# EAGLE schematic Cyclone-Pulse-Wrangler-Mainboard (EAGLE 9.6.2)
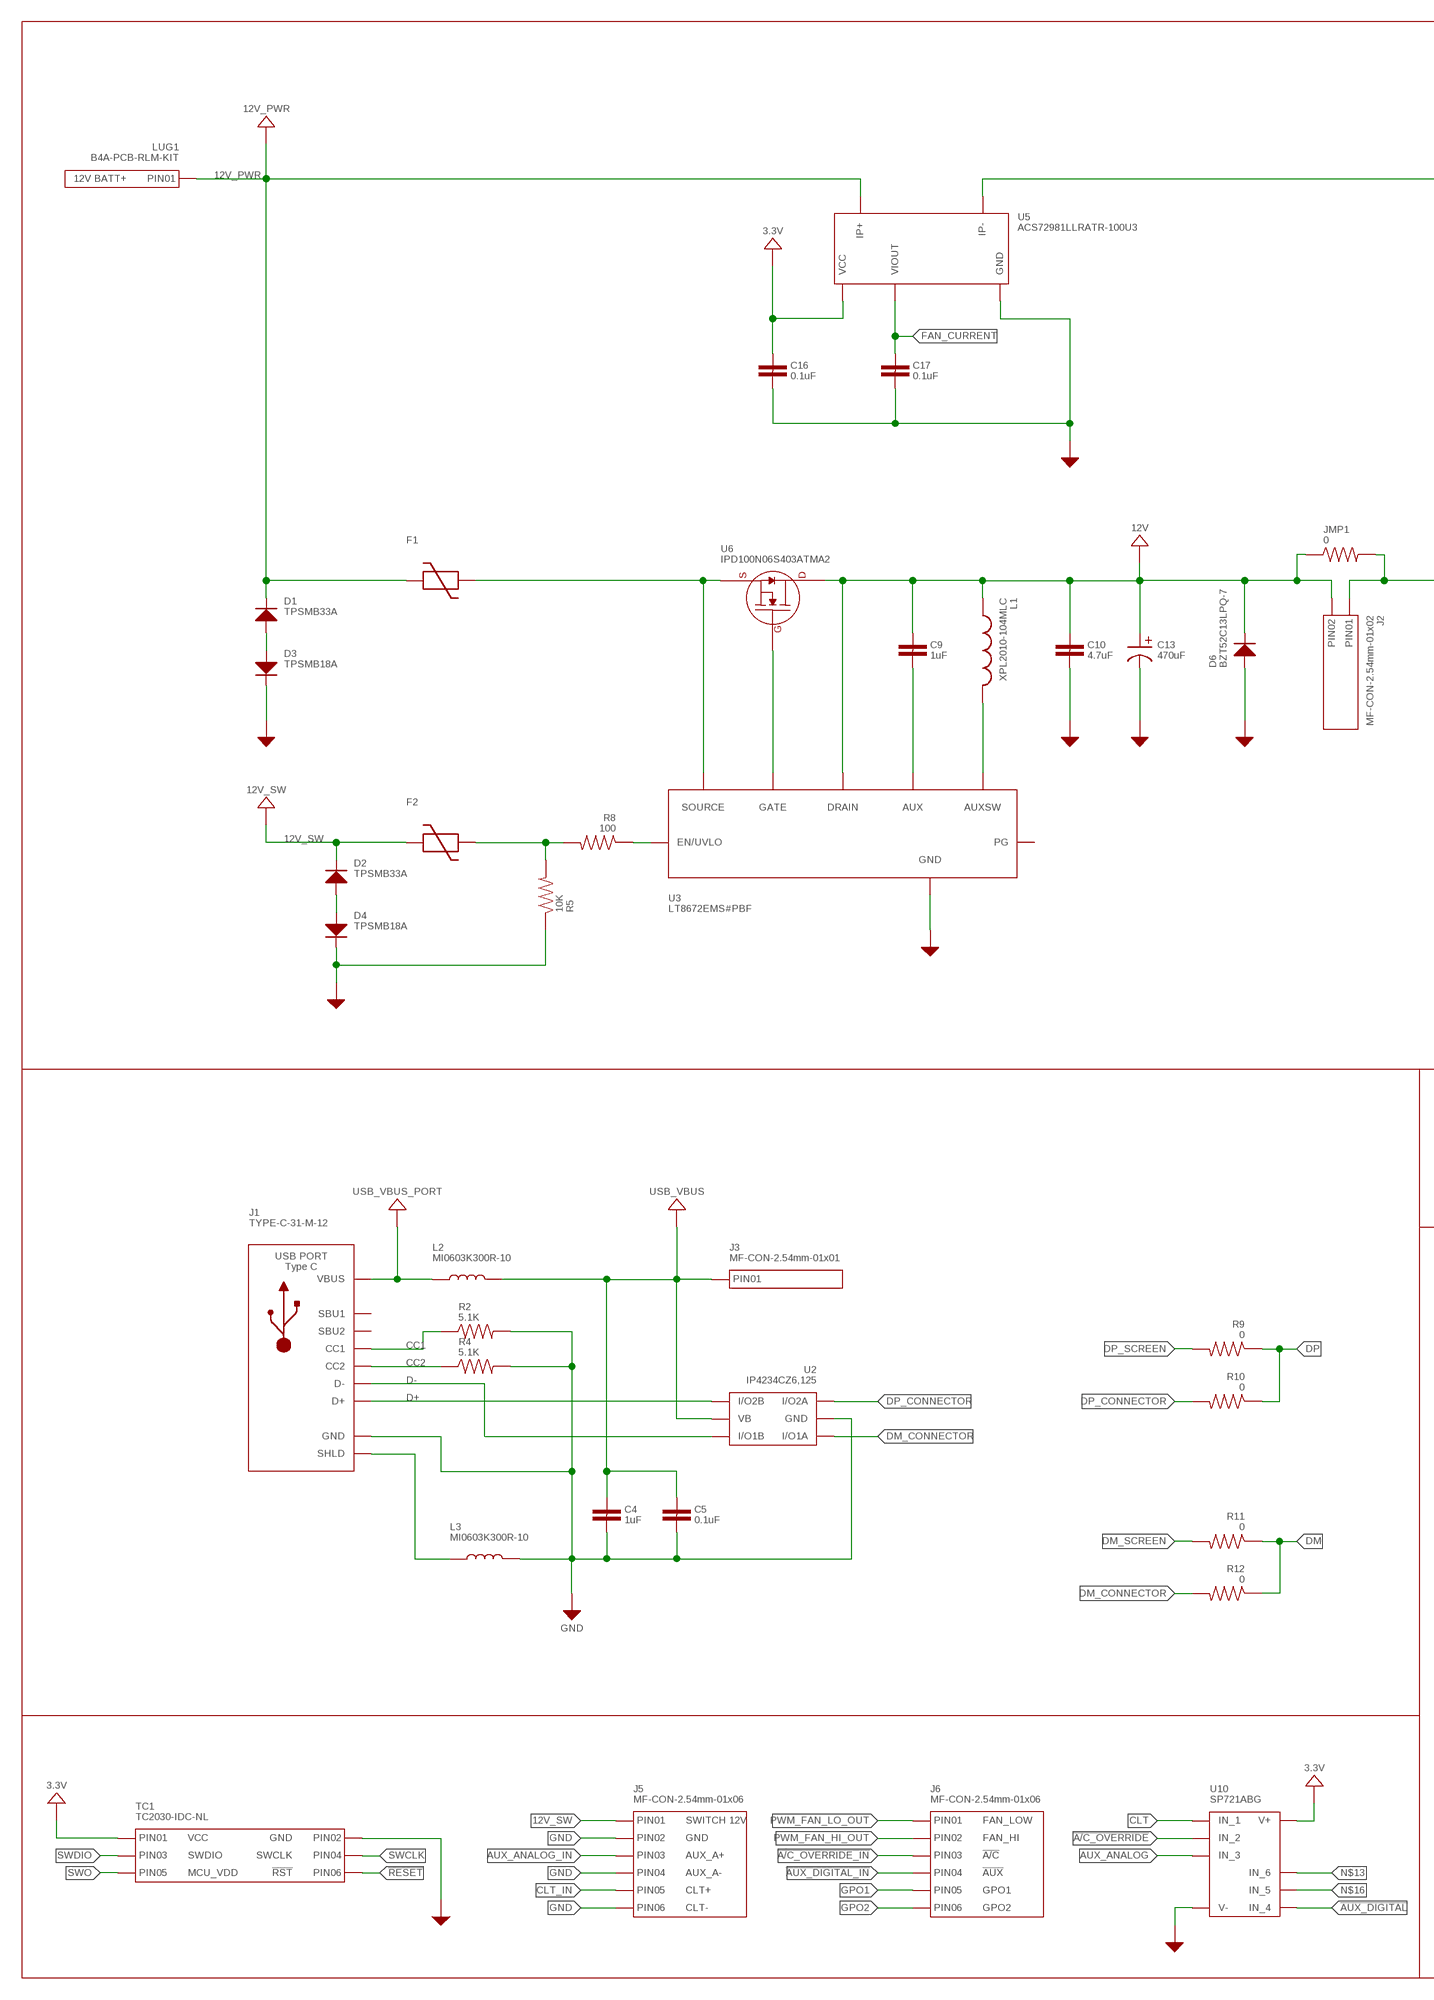
[diagram p0: schematic, sheet 1, part 1 of 3]
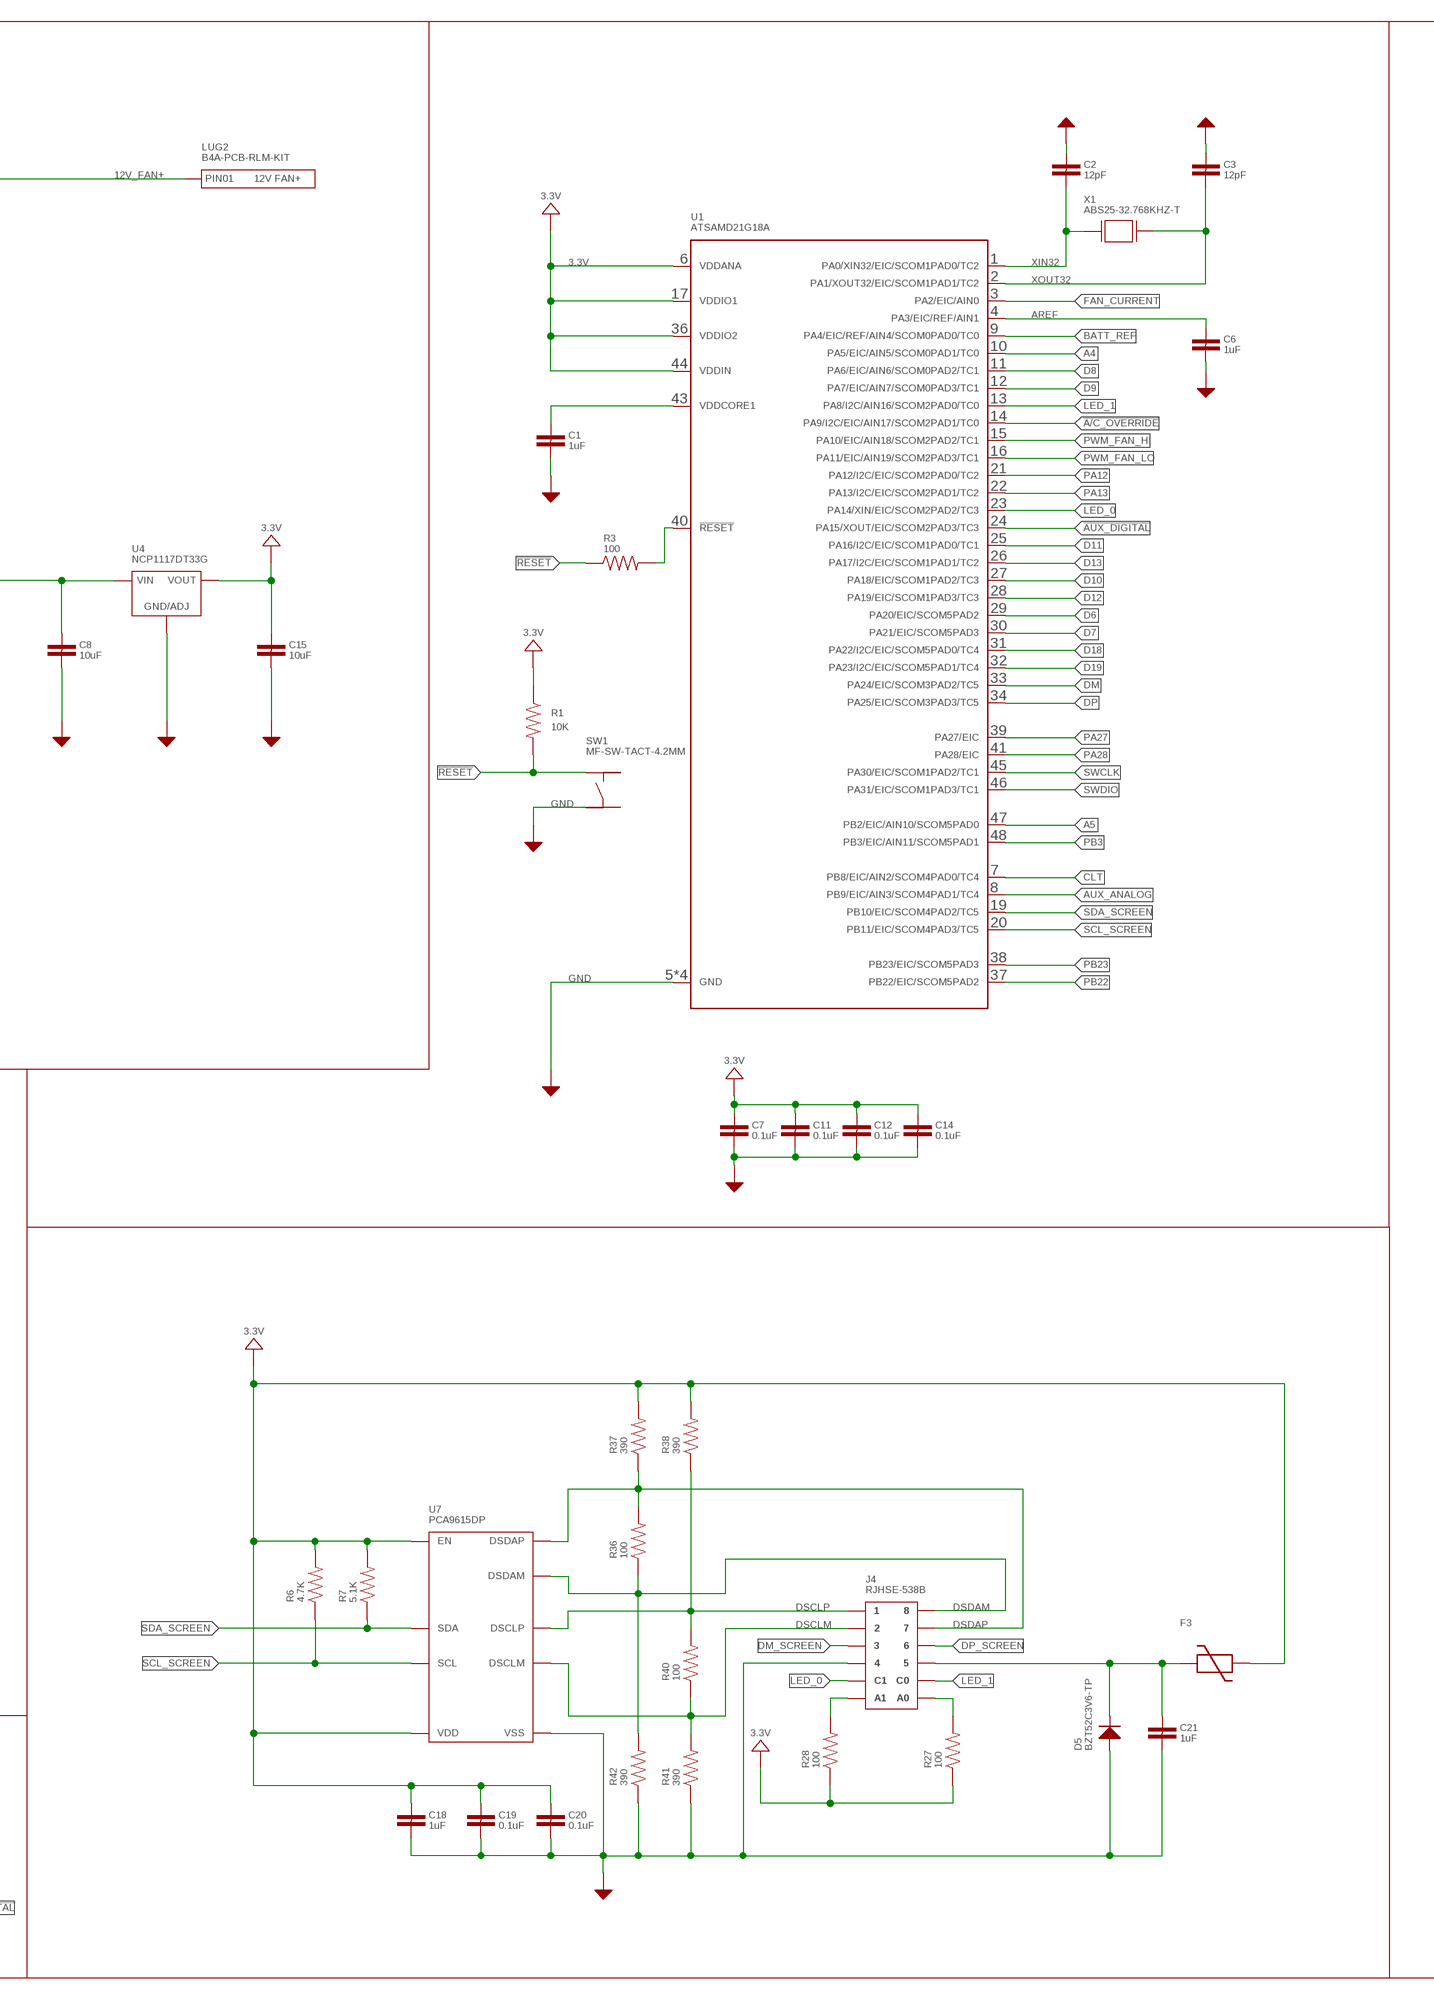
[diagram p1: schematic, sheet 1, part 2 of 3]
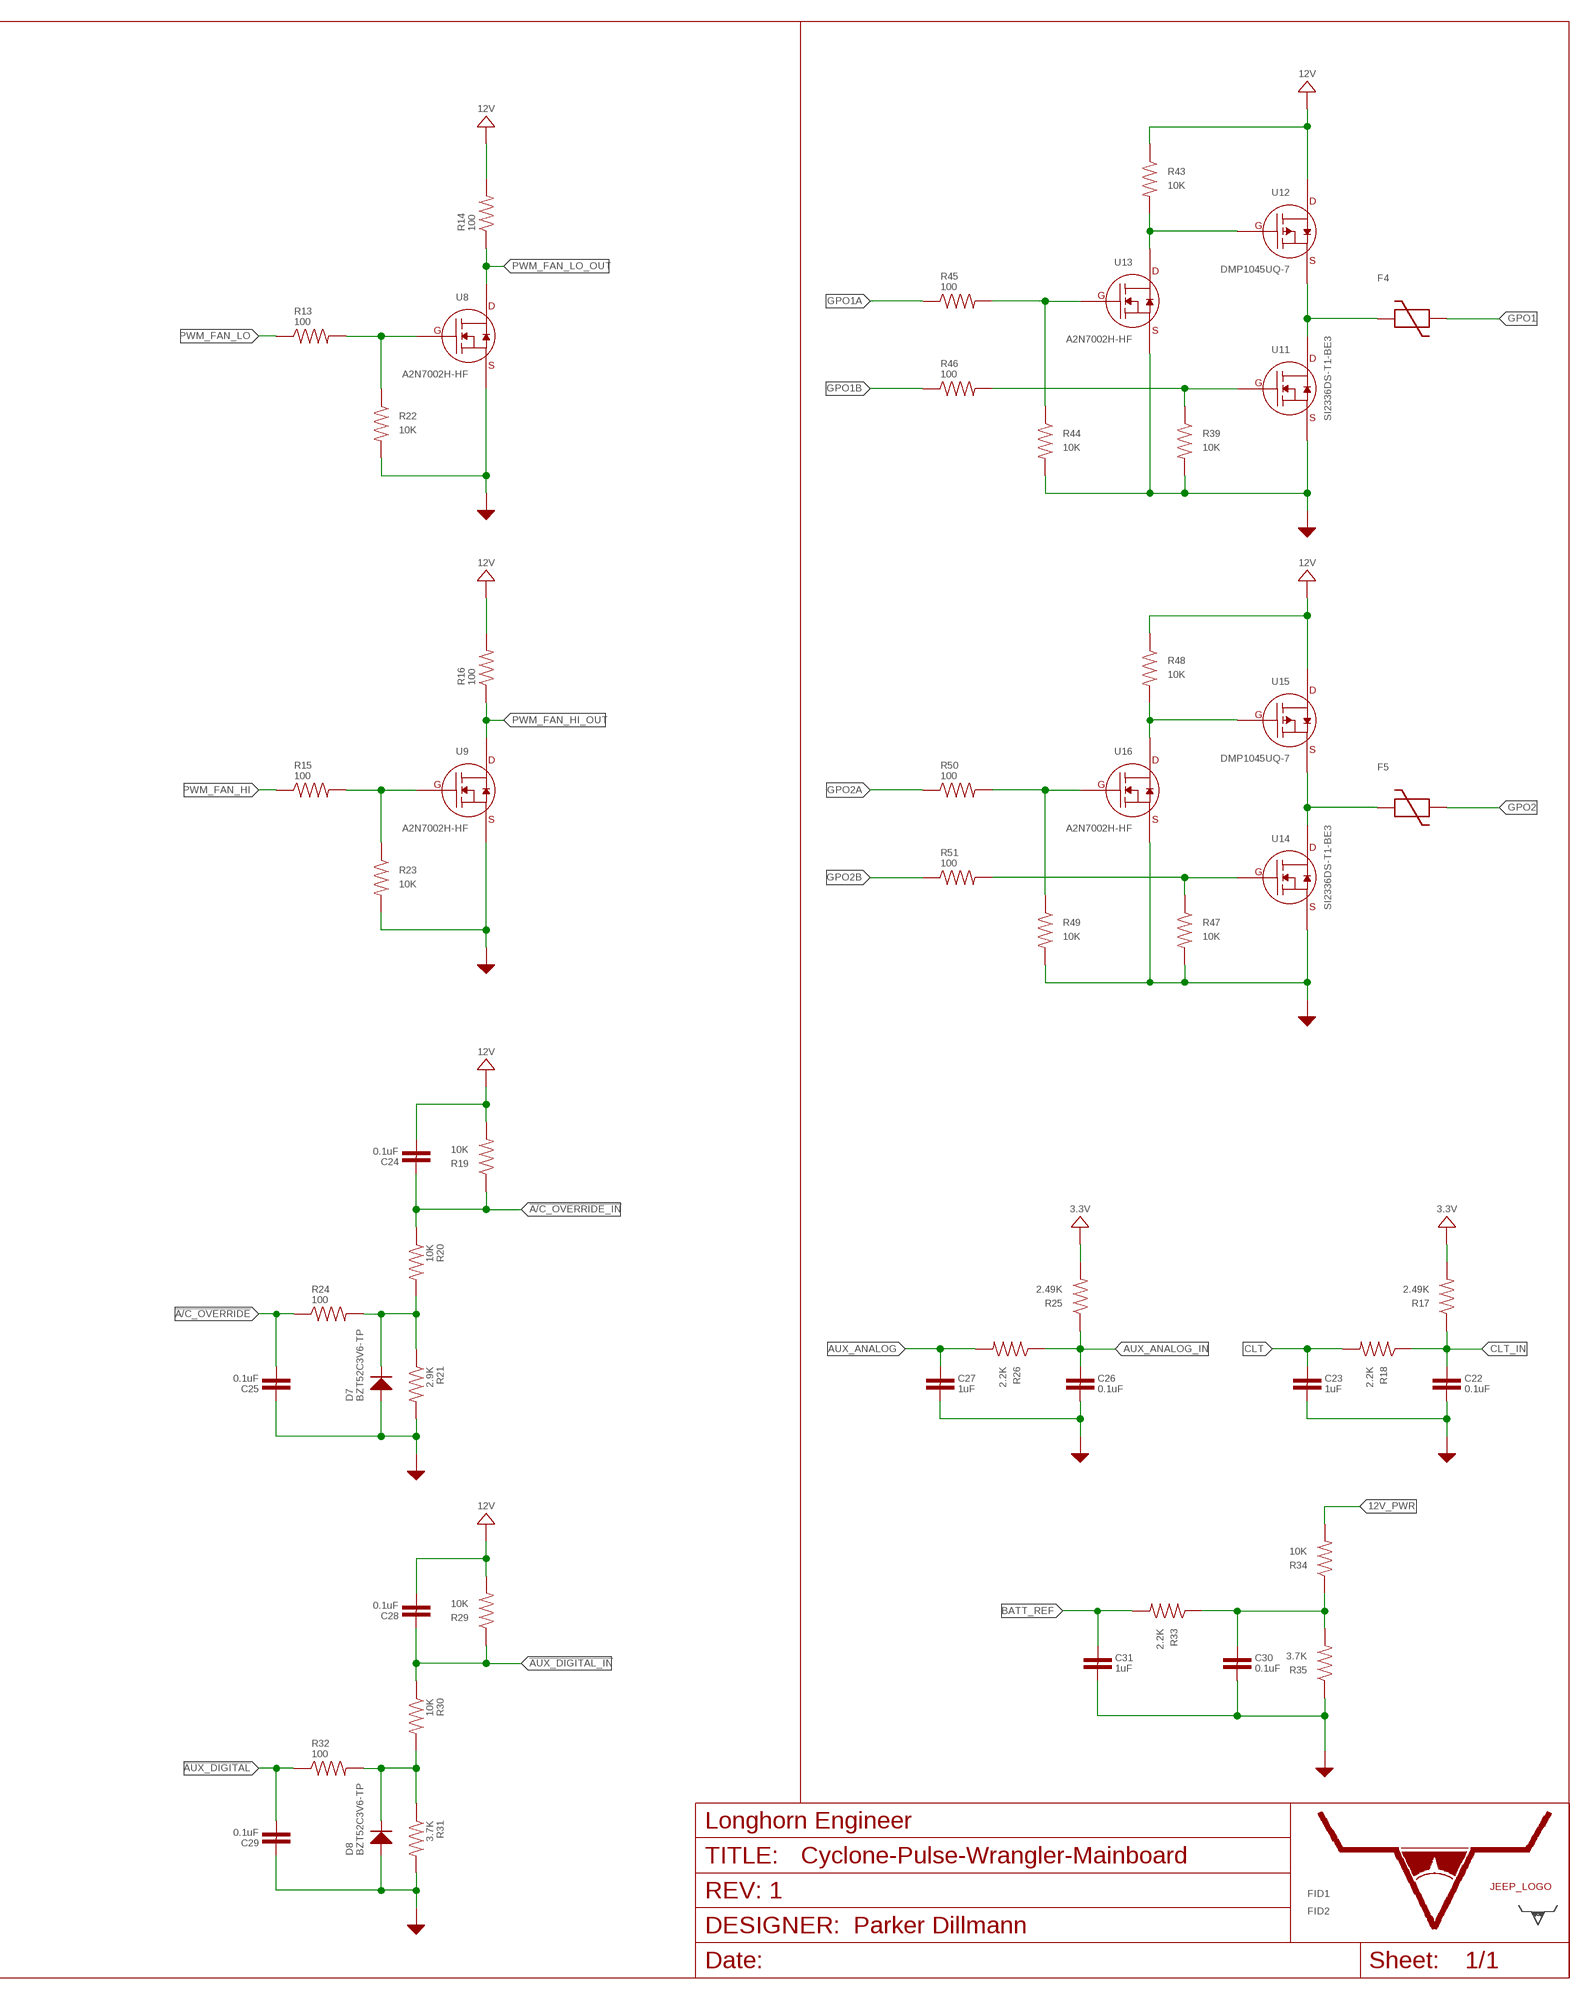
[diagram p2: schematic, sheet 1, part 3 of 3]

## Parts
C1  1uF  CAPACITOR_NON_POLAR_0805  [0805]
C2  12pF  CAPACITOR_NON_POLAR_0805  [0805]
C3  12pF  CAPACITOR_NON_POLAR_0805  [0805]
C4  1uF  CAPACITOR_NON_POLAR_0805  [0805]
C5  0.1uF  CAPACITOR_NON_POLAR_0805  [0805]
C6  1uF  CAPACITOR_NON_POLAR_0805  [0805]
C7  0.1uF  CAPACITOR_NON_POLAR_0805  [0805]
C8  10uF  CAPACITOR_NON_POLAR_1210  [1210]
C9  1uF  CAPACITOR_NON_POLAR_0805  [0805]
C10  4.7uF  CAPACITOR_NON_POLAR_1210  [1210]
C11  0.1uF  CAPACITOR_NON_POLAR_0805  [0805]
C12  0.1uF  CAPACITOR_NON_POLAR_0805  [0805]
C13  470uF  CAPACITOR_POLARIZED_10MM_SMD  [10MM_CAP_SMD]
C14  0.1uF  CAPACITOR_NON_POLAR_0805  [0805]
C15  10uF  CAPACITOR_NON_POLAR_1210  [1210]
C16  0.1uF  CAPACITOR_NON_POLAR_0805  [0805]
C17  0.1uF  CAPACITOR_NON_POLAR_0805  [0805]
C18  1uF  CAPACITOR_NON_POLAR_0805  [0805]
C19  0.1uF  CAPACITOR_NON_POLAR_0805  [0805]
C20  0.1uF  CAPACITOR_NON_POLAR_0805  [0805]
C21  1uF  CAPACITOR_NON_POLAR_0805  [0805]
C22  0.1uF  CAPACITOR_NON_POLAR_0805  [0805]
C23  1uF  CAPACITOR_NON_POLAR_0805  [0805]
C24  0.1uF  CAPACITOR_NON_POLAR_0805  [0805]
C25  0.1uF  CAPACITOR_NON_POLAR_0805  [0805]
C26  0.1uF  CAPACITOR_NON_POLAR_0805  [0805]
C27  1uF  CAPACITOR_NON_POLAR_0805  [0805]
C28  0.1uF  CAPACITOR_NON_POLAR_0805  [0805]
C29  0.1uF  CAPACITOR_NON_POLAR_0805  [0805]
C30  0.1uF  CAPACITOR_NON_POLAR_0805  [0805]
C31  1uF  CAPACITOR_NON_POLAR_0805  [0805]
D1  TPSMB33A  DIODE_DO-214AA  [DO-214AA]
D2  TPSMB33A  DIODE_DO-214AA  [DO-214AA]
D3  TPSMB18A  DIODE_DO-214AA  [DO-214AA]
D4  TPSMB18A  DIODE_DO-214AA  [DO-214AA]
D5  BZT52C3V6-TP  DIODE_SOD-123  [SOD-123]
D6  BZT52C13LPQ-7  DIODE_SOD-123  [SOD-123]
D7  BZT52C3V6-TP  DIODE_SOD-123  [SOD-123]
D8  BZT52C3V6-TP  DIODE_SOD-123  [SOD-123]
F1  PTC_FUSE_2920  [2920]
F2  PTC_FUSE_2920  [2920]
F3  PTC_FUSE_2920  [2920]
F4  PTC_FUSE_2920  [2920]
F5  PTC_FUSE_2920  [2920]
FID1  FIDUCIAL_0.5MM  [FIDUCIAL_0.5MM]
FID2  FIDUCIAL_0.5MM  [FIDUCIAL_0.5MM]
J1  TYPE-C-31-M-12  USB_TYPE-C_MINIMAL  [TYPE-C-31-M-12]
J2  MF-CON-2.54mm-01x02  CON_01X02_PTH_2.54MM  [PTH_2.54MM_01X02]
J3  MF-CON-2.54mm-01x01  CON_01X01_PTH_2.54MM  [PTH_2.54MM_01X01]
J4  RJHSE-538B  RJ45_SINGLE_RJHSE-538X  [RJHSE-538X]
J5  MF-CON-2.54mm-01x06  CON_01X06_PTH_2.54MM  [PTH_2.54MM_01X06]
J6  MF-CON-2.54mm-01x06  CON_01X06_PTH_2.54MM  [PTH_2.54MM_01X06]
JMP1  0  RESISTOR_0603  [R0603]
L1  XPL2010-104MLC  INDUCTOR_XPL2010  [XPL2010]
L2  MI0603K300R-10  INDUCTOR_0603  [L0603]
L3  MI0603K300R-10  INDUCTOR_0603  [L0603]
LUG1  B4A-PCB-RLM-KIT  CON_01X01_B4A-PCB-RLM  [B4A-PCB-RLM]
LUG2  B4A-PCB-RLM-KIT  CON_01X01_B4A-PCB-RLM  [B4A-PCB-RLM]
R1  10K  RESISTOR_0603  [R0603]
R2  5.1K  RESISTOR_0603  [R0603]
R3  100  RESISTOR_0603  [R0603]
R4  5.1K  RESISTOR_0603  [R0603]
R5  10K  RESISTOR_0603  [R0603]
R6  4.7K  RESISTOR_0603  [R0603]
R7  5.1K  RESISTOR_0603  [R0603]
R8  100  RESISTOR_0603  [R0603]
R9  0  RESISTOR_0603  [R0603]
R10  0  RESISTOR_0603  [R0603]
R11  0  RESISTOR_0603  [R0603]
R12  0  RESISTOR_0603  [R0603]
R13  100  RESISTOR_0603  [R0603]
R14  100  RESISTOR_0603  [R0603]
R15  100  RESISTOR_0603  [R0603]
R16  100  RESISTOR_0603  [R0603]
R17  2.49K  RESISTOR_0805  [R0805]
R18  2.2K  RESISTOR_0805  [R0805]
R19  10K  RESISTOR_0805  [R0805]
R20  10K  RESISTOR_0603  [R0603]
R21  2.9K  RESISTOR_0603  [R0603]
R22  10K  RESISTOR_0603  [R0603]
R23  10K  RESISTOR_0603  [R0603]
R24  100  RESISTOR_0603  [R0603]
R25  2.49K  RESISTOR_0805  [R0805]
R26  2.2K  RESISTOR_0805  [R0805]
R27  100  RESISTOR_0603  [R0603]
R28  100  RESISTOR_0603  [R0603]
R29  10K  RESISTOR_0805  [R0805]
R30  10K  RESISTOR_0603  [R0603]
R31  3.7K  RESISTOR_0603  [R0603]
R32  100  RESISTOR_0603  [R0603]
R33  2.2K  RESISTOR_0805  [R0805]
R34  10K  RESISTOR_0805  [R0805]
R35  3.7K  RESISTOR_0805  [R0805]
R36  100  RESISTOR_0603  [R0603]
R37  390  RESISTOR_0603  [R0603]
R38  390  RESISTOR_0603  [R0603]
R39  10K  RESISTOR_0603  [R0603]
R40  100  RESISTOR_0603  [R0603]
R41  390  RESISTOR_0603  [R0603]
R42  390  RESISTOR_0603  [R0603]
R43  10K  RESISTOR_0603  [R0603]
R44  10K  RESISTOR_0603  [R0603]
R45  100  RESISTOR_0603  [R0603]
R46  100  RESISTOR_0603  [R0603]
R47  10K  RESISTOR_0603  [R0603]
R48  10K  RESISTOR_0603  [R0603]
R49  10K  RESISTOR_0603  [R0603]
R50  100  RESISTOR_0603  [R0603]
R51  100  RESISTOR_0603  [R0603]
SW1  MF-SW-TACT-4.2MM  TACT_4.2MM  [TACT4.2MM]
TC1  TC2030-IDC-NL  CON_02X03_SWD2TC_TC2030-IDC-NL  [TC2030-IDC-NL]
U1  ATSAMD21G18A  ATSAMD21G18A-AU  [ATSAMD21G18A_TQFP-48]
U2  IP4234CZ6,125  IP4234CZ6  [IP4234CZ6_SOT-457-6]
U3  LT8672EMS#PBF  [LT8672_MSOP-10]
U4  NCP1117DT33G  LINEAR_VOTLAGE_REGULATORS_NCP1117DT  [NCP1117DT_DPAK-3]
U5  ACS72981LLRATR-100U3  ACS72981  [ACS72981_PSOF-7]
U6  IPD100N06S403ATMA2  MOSFET_N-CHANNEL_SINGLE_TO-252-3  [TO-252-3]
U7  PCA9615DP  [PCA9615DP_TSSOP-10]
U8  A2N7002H-HF  MOSFET_N-CHANNEL_SINGLE_SOT-23  [SOT-23-3]
U9  A2N7002H-HF  MOSFET_N-CHANNEL_SINGLE_SOT-23  [SOT-23-3]
U10  SP721ABG  [SP721_SOIC-8]
U11  SI2336DS-T1-BE3  MOSFET_N-CHANNEL_SINGLE_SOT-23  [SOT-23-3]
U12  DMP1045UQ-7  MOSFET_P-CHANNEL_SINGLE_SOT-23  [SOT-23-3]
U13  A2N7002H-HF  MOSFET_N-CHANNEL_SINGLE_SOT-23  [SOT-23-3]
U14  SI2336DS-T1-BE3  MOSFET_N-CHANNEL_SINGLE_SOT-23  [SOT-23-3]
U15  DMP1045UQ-7  MOSFET_P-CHANNEL_SINGLE_SOT-23  [SOT-23-3]
U16  A2N7002H-HF  MOSFET_N-CHANNEL_SINGLE_SOT-23  [SOT-23-3]
U$1  LHE_FRAME  [LHE_FRAME]
U$35  JEEP_LOGO_SILK_MEDIUM  [JEEP_SILK_MEDIUM]
U$42  LHE_LOGOLHE_LOGO  [LHE_LOGO]
X1  ABS25-32.768KHZ-T  CYRSTAL_ABS25  [ABS25_SERIES]

## Nets
3.3V: C7.1 C11.1 C12.1 C14.1 C15.1 C16.1 C18.1 C19.1 C20.1 F3.2 R1.P$1 R6.P$2 R7.P$2 R17.P$2 R25.P$2 R37.P$2 R38.P$2 TC1.P$1(PIN1) U1.6(VDDANA) U1.17(VDDIO1) U1.36(VDDIO2) U1.44(VDDIN) U4.TAB(OUT) U5.P$1(VCC) U7.P$1(VDD) U7.P$3(EN) U7.P$10(VDD) U10.8(V+)
3.3V_SCREEN_OUT: C21.1 D5.1(CATHODE) F3.1 J4.5
12V: C9.1 C10.1 C13.POS C24.2 C28.2 D6.1(CATHODE) J2.P$2(PIN2) JMP1.P$1 L1.P$1 R14.P$2 R16.P$2 R19.P$2 R29.P$2 R43.P$1 R48.P$1 U3.8(DRAIN) U6.PAD(DRAIN) U12.3(DRAIN) U15.3(DRAIN)
12V_FAN+: LUG2.P$1(PIN1) LUG2.P$2(PIN1) U5.P$6(IP-)
12V_PWR: D1.C(CATHODE) F1.1 LUG1.P$1(PIN1) LUG1.P$2(PIN1) R34.P$2 U5.P$5(IP+)
12V_SW: D2.C(CATHODE) F2.1 J5.P$1(PIN1)
!A/C_OVERRIDE: C25.2 D7.1(CATHODE) D8.1(CATHODE) R20.P$2 R21.P$1 R24.P$1 R24.P$2 R30.P$2 R31.P$1 R32.P$2 U1.14(PA9/I2C/EIC/AIN17/SCOM2PAD1/TC0) U10.2(IN_2)
!A/C_OVERRIDE_IN: C24.1 J6.P$3(PIN3) R19.P$1 R20.P$1
!AUX_DIGITAL: C29.2 R32.P$1 U1.24(PA15/XOUT/EIC/SCOM2PAD3/TC3) U10.5(IN_4)
!AUX_DIGITAL_IN: C28.1 J6.P$4(PIN4) R29.P$1 R30.P$1
!RESET: R1.P$2 R3.P$1 SW1.P$1 TC1.P$6(PIN6)
A4: U1.10(PA5/EIC/AIN5/SCOM0PAD1/TC0)
A5: U1.47(PB2/EIC/AIN10/SCOM5PAD0)
AREF: C6.1 U1.4(PA3/EIC/REF/AIN1)
AUX_ANALOG: C27.1 R26.P$2 U1.8(PB9/EIC/AIN3/SCOM4PAD1/TC4) U10.3(IN_3)
AUX_ANALOG_IN: C26.1 C30.1 J5.P$3(PIN3) R25.P$1 R26.P$1 R33.P$1 R34.P$1 R35.P$2
BATT_REF: C31.1 R33.P$2 U1.9(PA4/EIC/REF/AIN4/SCOM0PAD0/TC0)
CC1: J1.A5(CC1) R2.P$1
CC2: J1.B5(CC2) R4.P$1
CLT: C23.1 R18.P$2 U1.7(PB8/EIC/AIN2/SCOM4PAD0/TC4) U10.1(IN_1)
CLT_IN: C22.1 J5.P$5(PIN5) R17.P$1 R18.P$1
D6: U1.29(PA20/EIC/SCOM5PAD2)
D7: U1.30(PA21/EIC/SCOM5PAD3)
D8: U1.11(PA6/EIC/AIN6/SCOM0PAD2/TC1)
D9: U1.12(PA7/EIC/AIN7/SCOM0PAD3/TC1)
D10: U1.27(PA18/EIC/SCOM1PAD2/TC3)
D11: U1.25(PA16/I2C/EIC/SCOM1PAD0/TC1)
D12: U1.28(PA19/EIC/SCOM1PAD3/TC3)
D13: U1.26(PA17/I2C/EIC/SCOM1PAD1/TC2)
D18: U1.31(PA22/I2C/EIC/SCOM5PAD0/TC4)
D19: U1.32(PA23/I2C/EIC/SCOM5PAD1/TC4)
D+: J1.A6(D+) J1.B6(D+) U2.4(I/O2B)
D-: J1.A7(D-) J1.B7(D-) U2.3(I/O1B)
DM: R11.P$1 R12.P$1 U1.33(PA24/EIC/SCOM3PAD2/TC5)
DM_CONNECTOR: R12.P$2 U2.1(I/O1A)
DM_SCREEN: J4.3 R11.P$2
DP: R9.P$1 R10.P$1 U1.34(PA25/EIC/SCOM3PAD3/TC5)
DP_CONNECTOR: R10.P$2 U2.6(I/O2A)
DP_SCREEN: J4.6 R9.P$2
DSCLM: J4.2 R40.P$1 R41.P$2 U7.P$6(DSCLM)
DSCLP: J4.1 R38.P$1 R40.P$2 U7.P$7(DSCLP)
DSDAM: J4.8 R36.P$1 R42.P$2 U7.P$9(DSDAM)
DSDAP: J4.7 R36.P$2 R37.P$1 U7.P$8(DSDAP)
FAN_CURRENT: C17.1 U1.3(PA2/EIC/AIN0) U5.P$3(VIOUT)
GND: C1.2 C2.1 C3.1 C4.2 C5.2 C6.2 C7.2 C8.2 C10.2 C11.2 C12.2 C13.NEG C14.2 C15.2 C16.2 C17.2 C18.2 C19.2 C20.2 C21.2 C22.2 C23.2 C25.1 C26.2 C27.2 C29.1 C30.2 C31.2 D3.C(CATHODE) D4.C(CATHODE) D5.2(ANODE) D6.2(ANODE) D7.2(ANODE) D8.2(ANODE) J1.A1/B12(GND) J1.B1/A12(GND) J4.4 J5.P$2(PIN2) J5.P$4(PIN4) J5.P$6(PIN6) L3.P$2 R2.P$2 R4.P$2 R5.P$1 R21.P$2 R22.P$2 R23.P$2 R31.P$2 R35.P$1 R39.P$2 R41.P$1 R42.P$1 R44.P$2 R47.P$2 R49.P$2 SW1.P$3 TC1.P$2(PIN2) U1.5(GND) U1.18(GND) U1.35(GND) U1.42(GND) U2.2(GND) U3.2(GND) U3.4(GND) U4.1(GND) U5.P$2(GND) U5.P$4(GND) U5.P$7(GND) U7.P$5(VSS) U8.2(SOURCE) U9.2(SOURCE) U10.4(V-) U11.2(SOURCE) U13.2(SOURCE) U14.2(SOURCE) U16.2(SOURCE)
GPO1: F4.2 J6.P$5(PIN5)
GPO1A: R45.P$1
GPO1B: R46.P$1
GPO2: F5.2 J6.P$6(PIN6)
GPO2A: R50.P$1
GPO2B: R51.P$1
LED_0: J4.11(C1) U1.23(PA14/XIN/EIC/SCOM2PAD2/TC3)
LED_1: J4.9(C0) U1.13(PA8/I2C/AIN16/SCOM2PAD0/TC0)
N$1: D2.A(ANODE) D4.A(ANODE)
N$2: U3.10(GATE) U6.1(GATE)
N$3: F1.2 U3.9(SOURCE) U6.3(SOURCE)
N$4: F2.2 R5.P$2 R8.P$2
N$5: R8.P$1 U3.1(EN/UVLO)
N$6: R13.P$2 R22.P$1 U8.1(GATE)
N$7: R15.P$2 R23.P$1 U9.1(GATE)
N$8: F4.1 U11.3(DRAIN) U12.2(SOURCE)
N$9: D1.A(ANODE) D3.A(ANODE)
N$10: F5.1 U14.3(DRAIN) U15.2(SOURCE)
N$11: J4.12(A1) R28.P$2
N$12: J4.10(A0) R27.P$2
N$13: U10.7(IN_6)
N$14: C9.2 U3.7(AUX)
N$15: L1.P$2 U3.6(AUXSW)
N$16: U10.6(IN_5)
N$17: R43.P$2 U12.1(GATE) U13.3(DRAIN)
N$18: R39.P$1 R46.P$2 U11.1(GATE)
N$19: R48.P$2 U15.1(GATE) U16.3(DRAIN)
N$20: R44.P$1 R45.P$2 U13.1(GATE)
N$21: R47.P$1 R51.P$2 U14.1(GATE)
N$22: R49.P$1 R50.P$2 U16.1(GATE)
P$1: R27.P$1 R28.P$1 ; supply symbol labelled 3.3V
PA12: U1.21(PA12/I2C/EIC/SCOM2PAD0/TC2)
PA13: U1.22(PA13/I2C/EIC/SCOM2PAD1/TC2)
PA27: U1.39(PA27/EIC)
PA28: U1.41(PA28/EIC)
PB3: U1.48(PB3/EIC/AIN11/SCOM5PAD1)
PB22: U1.37(PB22/EIC/SCOM5PAD2)
PB23: U1.38(PB23/EIC/SCOM5PAD3)
PWM_FAN_HI: R15.P$1 U1.15(PA10/EIC/AIN18/SCOM2PAD2/TC1)
PWM_FAN_HI_OUT: J6.P$2(PIN2) R16.P$1 U9.3(DRAIN)
PWM_FAN_LO: R13.P$1 U1.16(PA11/EIC/AIN19/SCOM2PAD3/TC1)
PWM_FAN_LO_OUT: J6.P$1(PIN1) R14.P$1 U8.3(DRAIN)
REG_INPUT: C8.1 J2.P$1(PIN1) JMP1.P$2 U4.3(IN)
RESETLIN: R3.P$2 U1.40(!RESET)
SCL_SCREEN: R6.P$1 U1.20(PB11/EIC/SCOM4PAD3/TC5) U7.P$4(SCL)
SDA_SCREEN: R7.P$1 U1.19(PB10/EIC/SCOM4PAD2/TC5) U7.P$2(SDA)
SHLD: J1.MT_B_0(SHLD) J1.MT_B_1(SHLD) J1.MT_B_2(SHLD) J1.MT_B_3(SHLD) J1.MT_T_0(SHLD) J1.MT_T_1(SHLD) J1.MT_T_2(SHLD) J1.MT_T_3(SHLD) L3.P$1
SWCLK: TC1.P$4(PIN4) U1.45(PA30/EIC/SCOM1PAD2/TC1)
SWDIO: TC1.P$3(PIN3) U1.46(PA31/EIC/SCOM1PAD3/TC1)
SWO: TC1.P$5(PIN5)
USB_VBUS: C4.1 C5.1 J3.P$1(PIN1) L2.P$2 U2.5(VB)
USB_VBUS_PORT: J1.A4/B9(VBUS) J1.B4/A9(VBUS) L2.P$1
VDDCORE: C1.1 U1.43(VDDCORE1)
XIN32: C2.2 U1.1(PA0/XIN32/EIC/SCOM1PAD0/TC2) X1.1(X0)
XOUT32: C3.2 U1.2(PA1/XOUT32/EIC/SCOM1PAD1/TC2) X1.4(X1)
Unconnected: J1.A8(SBU1) J1.B8(SBU2) SW1.P$2 SW1.P$4 U3.3(PG)

## Library data of the parts
C1-C4 C6 C9 C23 C27 C31 = PP_Passives:CAPACITOR_NON_POLAR: Capacitor Non Polarized; MPN: C0805X105K5RACAUTO
C5 C7 C8 C11 C12 C14-C17 C22 C24-C26 C28-C30 = PP_Passives:CAPACITOR_NON_POLAR: Capacitor Non Polarized
C10 = PP_Passives:CAPACITOR_NON_POLAR: Capacitor Non Polarized; MPN: UMJ325AB7475KMHP
C13 = PP_Passives:CAPACITOR_POLARIZED: Polarized capacitors; MPN: EEH-ZS1V471P
C18 C21 = PP_Passives:CAPACITOR_NON_POLAR: Capacitor Non Polarized; MPN: C0805X105K5RACAUTO; SPICEPREFIX: C
C19 C20 = PP_Passives:CAPACITOR_NON_POLAR: Capacitor Non Polarized; SPICEPREFIX: C
D1 D2 = PP_Passives:DIODE: Diode - Single; MPN: TPSMB33A
D3 D4 = PP_Passives:DIODE: Diode - Single; MPN: TPSMB18A
D5 = PP_Passives:DIODE: Diode - Single; SPICEPREFIX: D
D6-D8 = PP_Passives:DIODE: Diode - Single
F1 F2 F4 F5 = PP_Passives:PTC_FUSE
F3 = PP_Passives:PTC_FUSE; SPICEPREFIX: F
FID1 FID2 = MF_Aesthetics:FIDUCIAL: Library: MF_Aesthetics Description: Fiducial marking for PCB alignment inside PNP and other machines.; HOUSEPART: NO; POPULATE: 0
J1 = PP_Connectors:USB_TYPE-C_MINIMAL; MPN: TYPE-C-31-M-12; POPULATE: 1
J2 = MF_Connectors:CON_01X02: Library: MF_Connectors Description: Header Connector with 02 Positions and 01 Rows. Use the LABEL Attribute to label the pin on the schematic and PCB. You can remove the attributes on the PCB by using the SMASH function on the part and then deleting the text.; HOUSEPART: YES; MPN: MF-CON-2.54mm-01x02; POPULATE: 1; URL: https://factory.macrofab.com/part/MF-CON-2.54mm-01x02
J3 = MF_Connectors:CON_01X01: Library: MF_Connectors Description: Header Connector with 01 Positions and 01 Rows. Use the LABEL Attribute to label the pin on the schematic and PCB. You can remove the attributes on the PCB by using the SMASH function on the part and then deleting the text.; HOUSEPART: YES; MPN: MF-CON-2.54mm-01x01; POPULATE: 1; URL: https://factory.macrofab.com/part/MF-CON-2.54mm-01x01
J4 = PP_Connectors:RJ45_SINGLE: RJ45 Connectors - Single; POPULATE: 1; SPICEPREFIX: X
J5 = MF_Connectors:CON_01X06: Library: MF_Connectors Description: Header Connector with 6 Positions and 01 Rows. Use the LABEL Attribute to label the pin on the schematic and PCB. You can remove the attributes on the PCB by using the SMASH function on the part and then deleting the text.; HOUSEPART: YES; LABEL01: SWITCH 12V; LABEL02: GND; LABEL03: AUX_A+; LABEL04: AUX_A-; LABEL05: CLT+; LABEL06: CLT-; MPN: MF-CON-2.54mm-01x06; POPULATE: 1; URL: https://factory.macrofab.com/part/MF-CON-2.54mm-01x06
J6 = MF_Connectors:CON_01X06: Library: MF_Connectors Description: Header Connector with 6 Positions and 01 Rows. Use the LABEL Attribute to label the pin on the schematic and PCB. You can remove the attributes on the PCB by using the SMASH function on the part and then deleting the text.; HOUSEPART: YES; LABEL01: FAN_LOW; LABEL02: FAN_HI; LABEL03: !A/C; LABEL04: !AUX; LABEL05: GPO1; LABEL06: GPO2; MPN: MF-CON-2.54mm-01x06; POPULATE: 1; URL: https://factory.macrofab.com/part/MF-CON-2.54mm-01x06
JMP1 R2 R4 R17-R19 R25 R26 R29 R33-R35 = MF_Passives:RESISTOR: Library: MF_Passives Description: Device for Resistors. Manufacture part number (MPN), Voltage, Tolerance, and Wattage Rating can be added via Attributes. Check https://factory.macrofab.com/parts for the house parts list.; POPULATE: 1
L1 = PP_Passives:INDUCTOR: Inductors; MPN: XPL2010-104MLC
L2 L3 = MF_Passives:INDUCTOR: Library: MF_Passives Description: Device for Inductors. Manufacture part number (MPN) can be added via Attributes. Check https://factory.macrofab.com/parts for the house parts list.; MPN: MI0603K300R-10; POPULATE: 1
LUG1 = PP_Connectors:CON_01X01; LABEL01: 12V BATT+
LUG2 = PP_Connectors:CON_01X01; LABEL01: 12V FAN+
R1 R5 R20 R22 R23 R30 R39 R43 R44 R47-R49 = MF_Passives:RESISTOR: Library: MF_Passives Description: Device for Resistors. Manufacture part number (MPN), Voltage, Tolerance, and Wattage Rating can be added via Attributes. Check https://factory.macrofab.com/parts for the house parts list.; MPN: MF-RES-0603-10K; POPULATE: 1
R3 R8 R13-R16 R24 R32 R45 R46 R50 R51 = MF_Passives:RESISTOR: Library: MF_Passives Description: Device for Resistors. Manufacture part number (MPN), Voltage, Tolerance, and Wattage Rating can be added via Attributes. Check https://factory.macrofab.com/parts for the house parts list.; MPN: MF-RES-0603-100; POPULATE: 1
R6 R7 R27 R28 = MF_Passives:RESISTOR: Library: MF_Passives Description: Device for Resistors. Manufacture part number (MPN), Voltage, Tolerance, and Wattage Rating can be added via Attributes. Check https://factory.macrofab.com/parts for the house parts list.; MPN: MF-RES-0603-100; POPULATE: 1; SPICEPREFIX: R
R9-R12 = MF_Passives:RESISTOR: Library: MF_Passives Description: Device for Resistors. Manufacture part number (MPN), Voltage, Tolerance, and Wattage Rating can be added via Attributes. Check https://factory.macrofab.com/parts for the house parts list.; MPN: MF-RES-0603-0; POPULATE: 1
R21 R31 = MF_Passives:RESISTOR: Library: MF_Passives Description: Device for Resistors. Manufacture part number (MPN), Voltage, Tolerance, and Wattage Rating can be added via Attributes. Check https://factory.macrofab.com/parts for the house parts list.; MPN: RN73H1JTTD3701B25; POPULATE: 1
R36-R38 R40-R42 = MF_Passives:RESISTOR: Library: MF_Passives Description: Device for Resistors. Manufacture part number (MPN), Voltage, Tolerance, and Wattage Rating can be added via Attributes. Check https://factory.macrofab.com/parts for the house parts list.; POPULATE: 1; SPICEPREFIX: R
SW1 = MF_Switches:TACT: Library: MF_Switches Description: Device for Tact Switches. Manufacture part number (MFG#) can be added via Attributes.; HOUSEPART: YES; MPN: MF-SW-TACT-4.2MM; POPULATE: 1; URL: https://factory.macrofab.com/part/MF-SW-TACT-4.2MM
TC1 = MF_Connectors:CON_02X03: Library: MF_Connectors Description: Header Connector with 6 Positions and 02 Rows. Use the LABEL Attribute to label the pin on the schematic and PCB. You can remove the attributes on the PCB by using the SMASH function on the part and then deleting the text.; HOUSEPART: NO; LABEL01: VCC; LABEL02: GND; LABEL03: SWDIO; LABEL04: SWCLK; LABEL05: MCU_VDD; LABEL06: !RST; MPN: TC2030-IDC-NL; POPULATE: 0; URL: http://www.tag-connect.com/TC2030-IDC-NL
U1 = PP_DigitalIC:ATSAMD21G18A; MPN: ATSAMD21G18A-AU; POPULATE: 1
U2 = PP_Passives:IP4234CZ6: Mouser Part #: 771-IP4234CZ6125 Manufacturer Part #: IP4234CZ6,125 Manufacturer: NXP Semiconductors Description: ESD Suppressors Single USB 2.0 ESD Protection 6-Pin http://www.mouser.com/ProductDetail/NXP-Semiconductors/IP4234CZ6125/?qs=sGAEpiMZZMvxHShE6Whpu7QUdHOfUl1T0xbl582qhFk%3d; MPN: IP4234CZ6,125; POPULATE: 1
U3 = PP_PowerIC:LT8672; MPN: LT8672EMS#PBF
U4 = PP_PowerIC:LINEAR_VOTLAGE_REGULATORS
U5 = PP_Sensors:ACS72981; MPN: ACS72981LLRATR-100U3
U6 = PP_DiscreteSemi:MOSFET_N-CHANNEL_SINGLE: Mosfet - N-Channel - Single; MPN: IPD100N06S403ATMA2
U7 = PP_DigitalIC:PCA9615; SPICEPREFIX: X
U8 U9 U11 U13 U14 U16 = PP_DiscreteSemi:MOSFET_N-CHANNEL_SINGLE: Mosfet - N-Channel - Single
U10 = PP_Passives:SP721
U12 U15 = PP_DiscreteSemi:MOSFET_P-CHANNEL_SINGLE
U$1 = PP_Aesthetics:LHE_FRAME; DNAME: Parker Dillmann; REVNUM: REV: 1
U$35 = PP_Aesthetics:JEEP_LOGO
U$42 = PP_Aesthetics:LHE_LOGO
X1 = MF_Frequency_Control:CYRSTAL: Library: MF_Frequency_Control Description: Device for two functional pin Cyrstal Oscillators.; HOUSEPART: NO; MPN: ABS25-32.768KHZ-T; POPULATE: 1; URL: http://www.abracon.com/Resonators/abs25.pdf